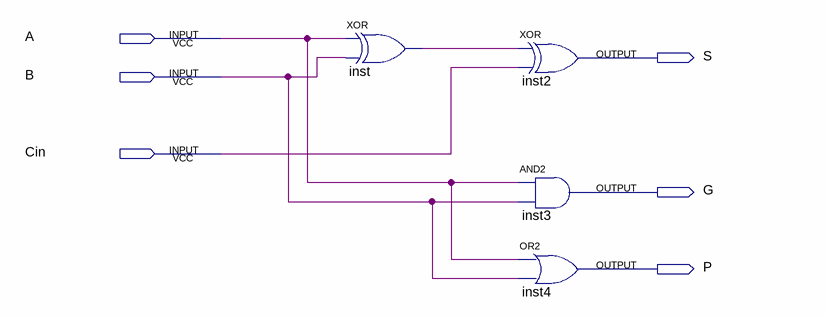
[diagram p0: schematic sheet]
// Quartus schematic FullAdder_Lookahead.bdf as structural Verilog: 4 symbols, 6 pins
module FullAdder_Lookahead (
  input  A,
  input  B,
  input  Cin,
  output S,
  output G,
  output P
);

  wire inst_out;

  xor inst (inst_out, A, B);
  xor inst2 (S, inst_out, Cin);
  and inst3 (G, A, B);
  or inst4 (P, A, B);
endmodule
